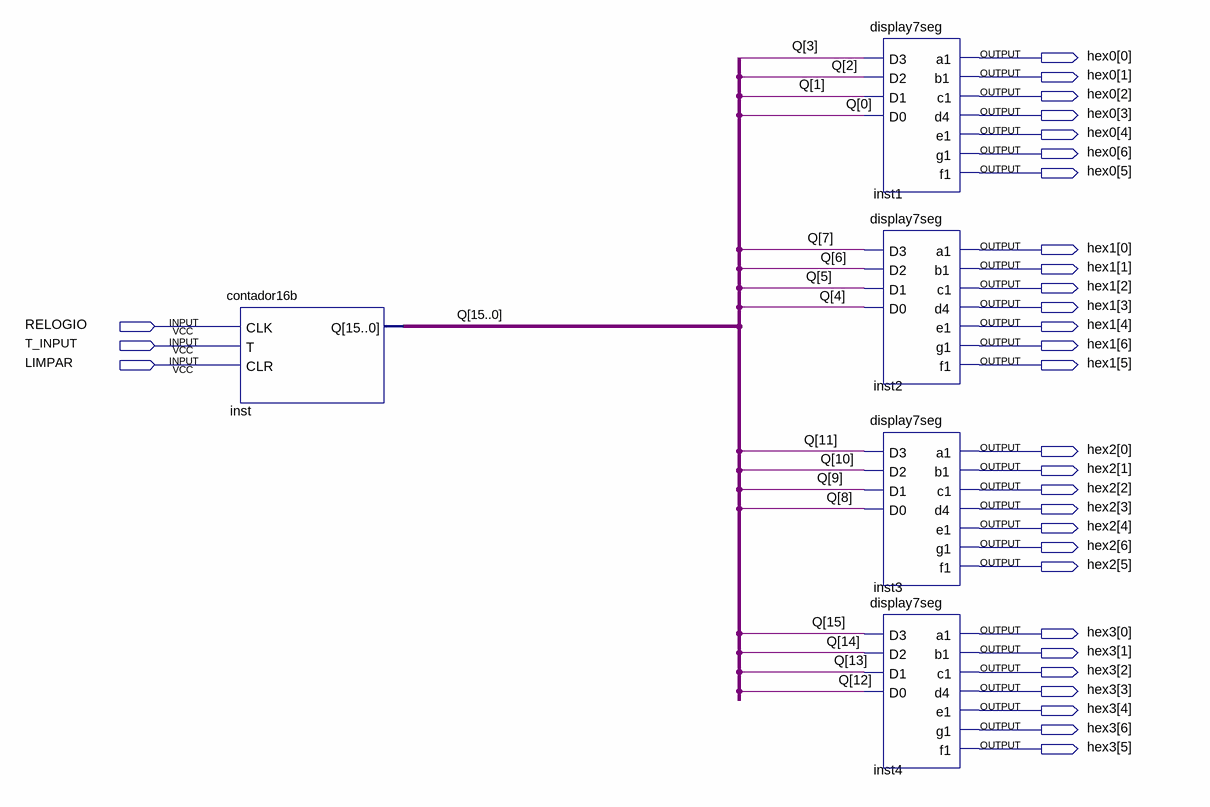
[diagram p0: schematic sheet]
// Quartus schematic Lab2Part4.bdf as structural Verilog: 5 symbols, 31 pins
module Lab2Part4 (
  input  RELOGIO,
  input  T_INPUT,
  input  LIMPAR,
  output [6:0] hex0,
  output [6:0] hex1,
  output [6:0] hex2,
  output [6:0] hex3
);

  wire [15:0] Q;

  contador16b inst (.CLK(RELOGIO), .T(T_INPUT), .CLR(LIMPAR), .Q(Q));
  display7seg inst1 (
    .D3(Q[3]), .D2(Q[2]), .D1(Q[1]), .D0(Q[0]), .a1(hex0[0]), .b1(hex0[1]), .c1(hex0[2]), .d4(hex0[3]),
    .e1(hex0[4]), .g1(hex0[6]), .f1(hex0[5]));
  display7seg inst2 (
    .D3(Q[7]), .D2(Q[6]), .D1(Q[5]), .D0(Q[4]), .a1(hex1[0]), .b1(hex1[1]), .c1(hex1[2]), .d4(hex1[3]),
    .e1(hex1[4]), .g1(hex1[6]), .f1(hex1[5]));
  display7seg inst3 (
    .D3(Q[11]), .D2(Q[10]), .D1(Q[9]), .D0(Q[8]), .a1(hex2[0]), .b1(hex2[1]), .c1(hex2[2]), .d4(hex2[3]),
    .e1(hex2[4]), .g1(hex2[6]), .f1(hex2[5]));
  display7seg inst4 (
    .D3(Q[15]), .D2(Q[14]), .D1(Q[13]), .D0(Q[12]), .a1(hex3[0]), .b1(hex3[1]), .c1(hex3[2]), .d4(hex3[3]),
    .e1(hex3[4]), .g1(hex3[6]), .f1(hex3[5]));
endmodule
